# Altium schematic sheet 7Seg.SchDoc
size A4
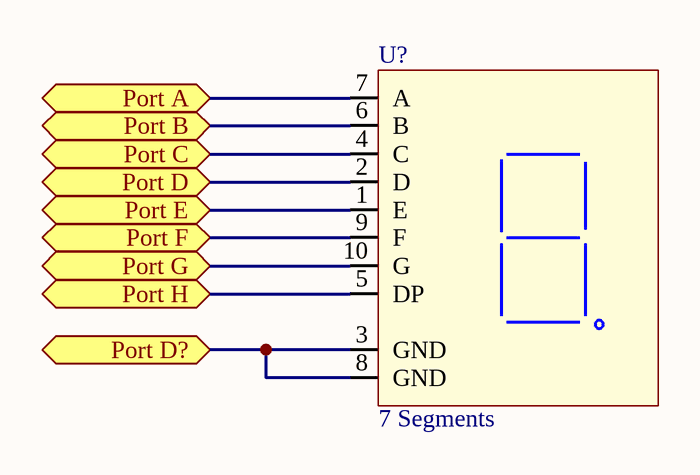
[diagram p0: 7Seg.SchDoc]

## Parts
U?  7 Segments  [SA10-21GWA]

## Ports
Port A, Port B, Port C, Port D, Port D?, Port E, Port F, Port G, Port H

## Nets
Port A: U?.7(A) ; port Port A
Port B: U?.6(B) ; port Port B
Port C: U?.4(C) ; port Port C
Port D: U?.2(D) ; port Port D
Port D?: U?.3(GND) U?.8(GND) ; port Port D?
Port E: U?.1(E) ; port Port E
Port F: U?.9(F) ; port Port F
Port G: U?.10(G) ; port Port G
Port H: U?.5(DP) ; port Port H

## Library data of the parts
U? = SC10-21SRWA: KingBright Led 7 Segments; Reference: SC10-21SRWA